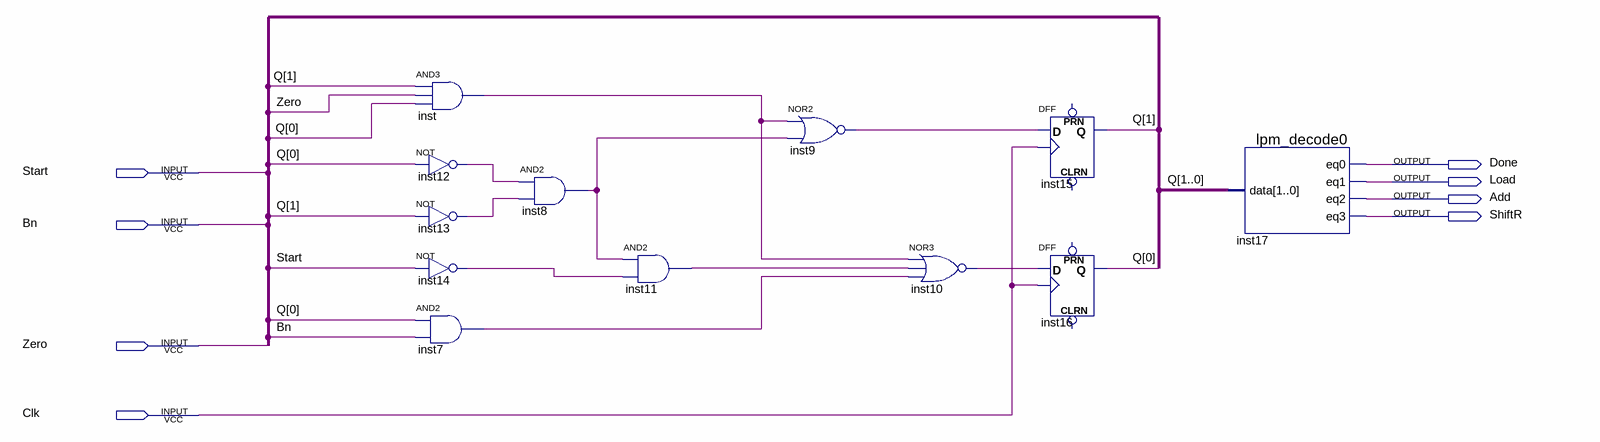
[diagram p0: schematic sheet]
// Quartus schematic UAZHL.bdf as structural Verilog: 12 symbols, 8 pins
module UAZHL (
  input  Start,
  input  Bn,
  input  Zero,
  input  Clk,
  output Done,
  output Load,
  output Add,
  output ShiftR
);

  wire inst7_out, inst8_out, inst9_out, inst10_out, inst11_out, inst12_out, inst13_out, inst14_out, inst_out;
  wire [1:0] Q;

  and inst (inst_out, Q[1], Zero, Q[0]);
  not inst12 (inst12_out, Q[0]);
  not inst13 (inst13_out, Q[1]);
  not inst14 (inst14_out, Start);
  and inst7 (inst7_out, Q[0], Bn);
  and inst8 (inst8_out, inst12_out, inst13_out);
  and inst11 (inst11_out, inst8_out, inst14_out);
  nor inst9 (inst9_out, inst_out, inst8_out);
  nor inst10 (inst10_out, inst_out, inst11_out, inst7_out);
  DFF inst15 (.CLK(Clk), .D(inst9_out), .Q(Q[1]));  // open: CLRN, PRN
  DFF inst16 (.CLK(Clk), .D(inst10_out), .Q(Q[0]));  // open: CLRN, PRN
  lpm_decode0 inst17 (.data(Q), .eq0(Done), .eq1(Load), .eq2(Add), .eq3(ShiftR));
endmodule
